# Altium schematic sheet sfpp_conn.SchDoc: SFP+ connectors
size A3; Date: DO NOT USE, RATHER USE PROJ OPTIONS; DrawnBy: DO NOT USE, RATHER USE PROJ OPTIONS; Engineer: DO NOT USE, RATHER USE PROJ OPTIONS; Organization: DO NOT USE, RATHER USE PROJ OPTIONS; DocumentNumber: DO NOT USE, RATHER USE PROJ OPTIONS; Revision: DO NOT USE, RATHER USE PROJ OPTIONS; SheetNumber: 4; SheetTotal: 4; SCH_Sheet_Filename: sfpp_conn.SchDoc; CurrentTime: DO NOT USE, RATHER USE PROJ OPTIONS; Time: DO NOT USE, RATHER USE PROJ OPTIONS; DocumentFullPathAndName: DO NOT USE, RATHER USE PROJ OPTIONS; DocumentName: DO NOT USE, RATHER USE PROJ OPTIONS; ModifiedDate: DO NOT USE, RATHER USE PROJ OPTIONS; ImagePath: DO NOT USE, RATHER USE PROJ OPTIONS
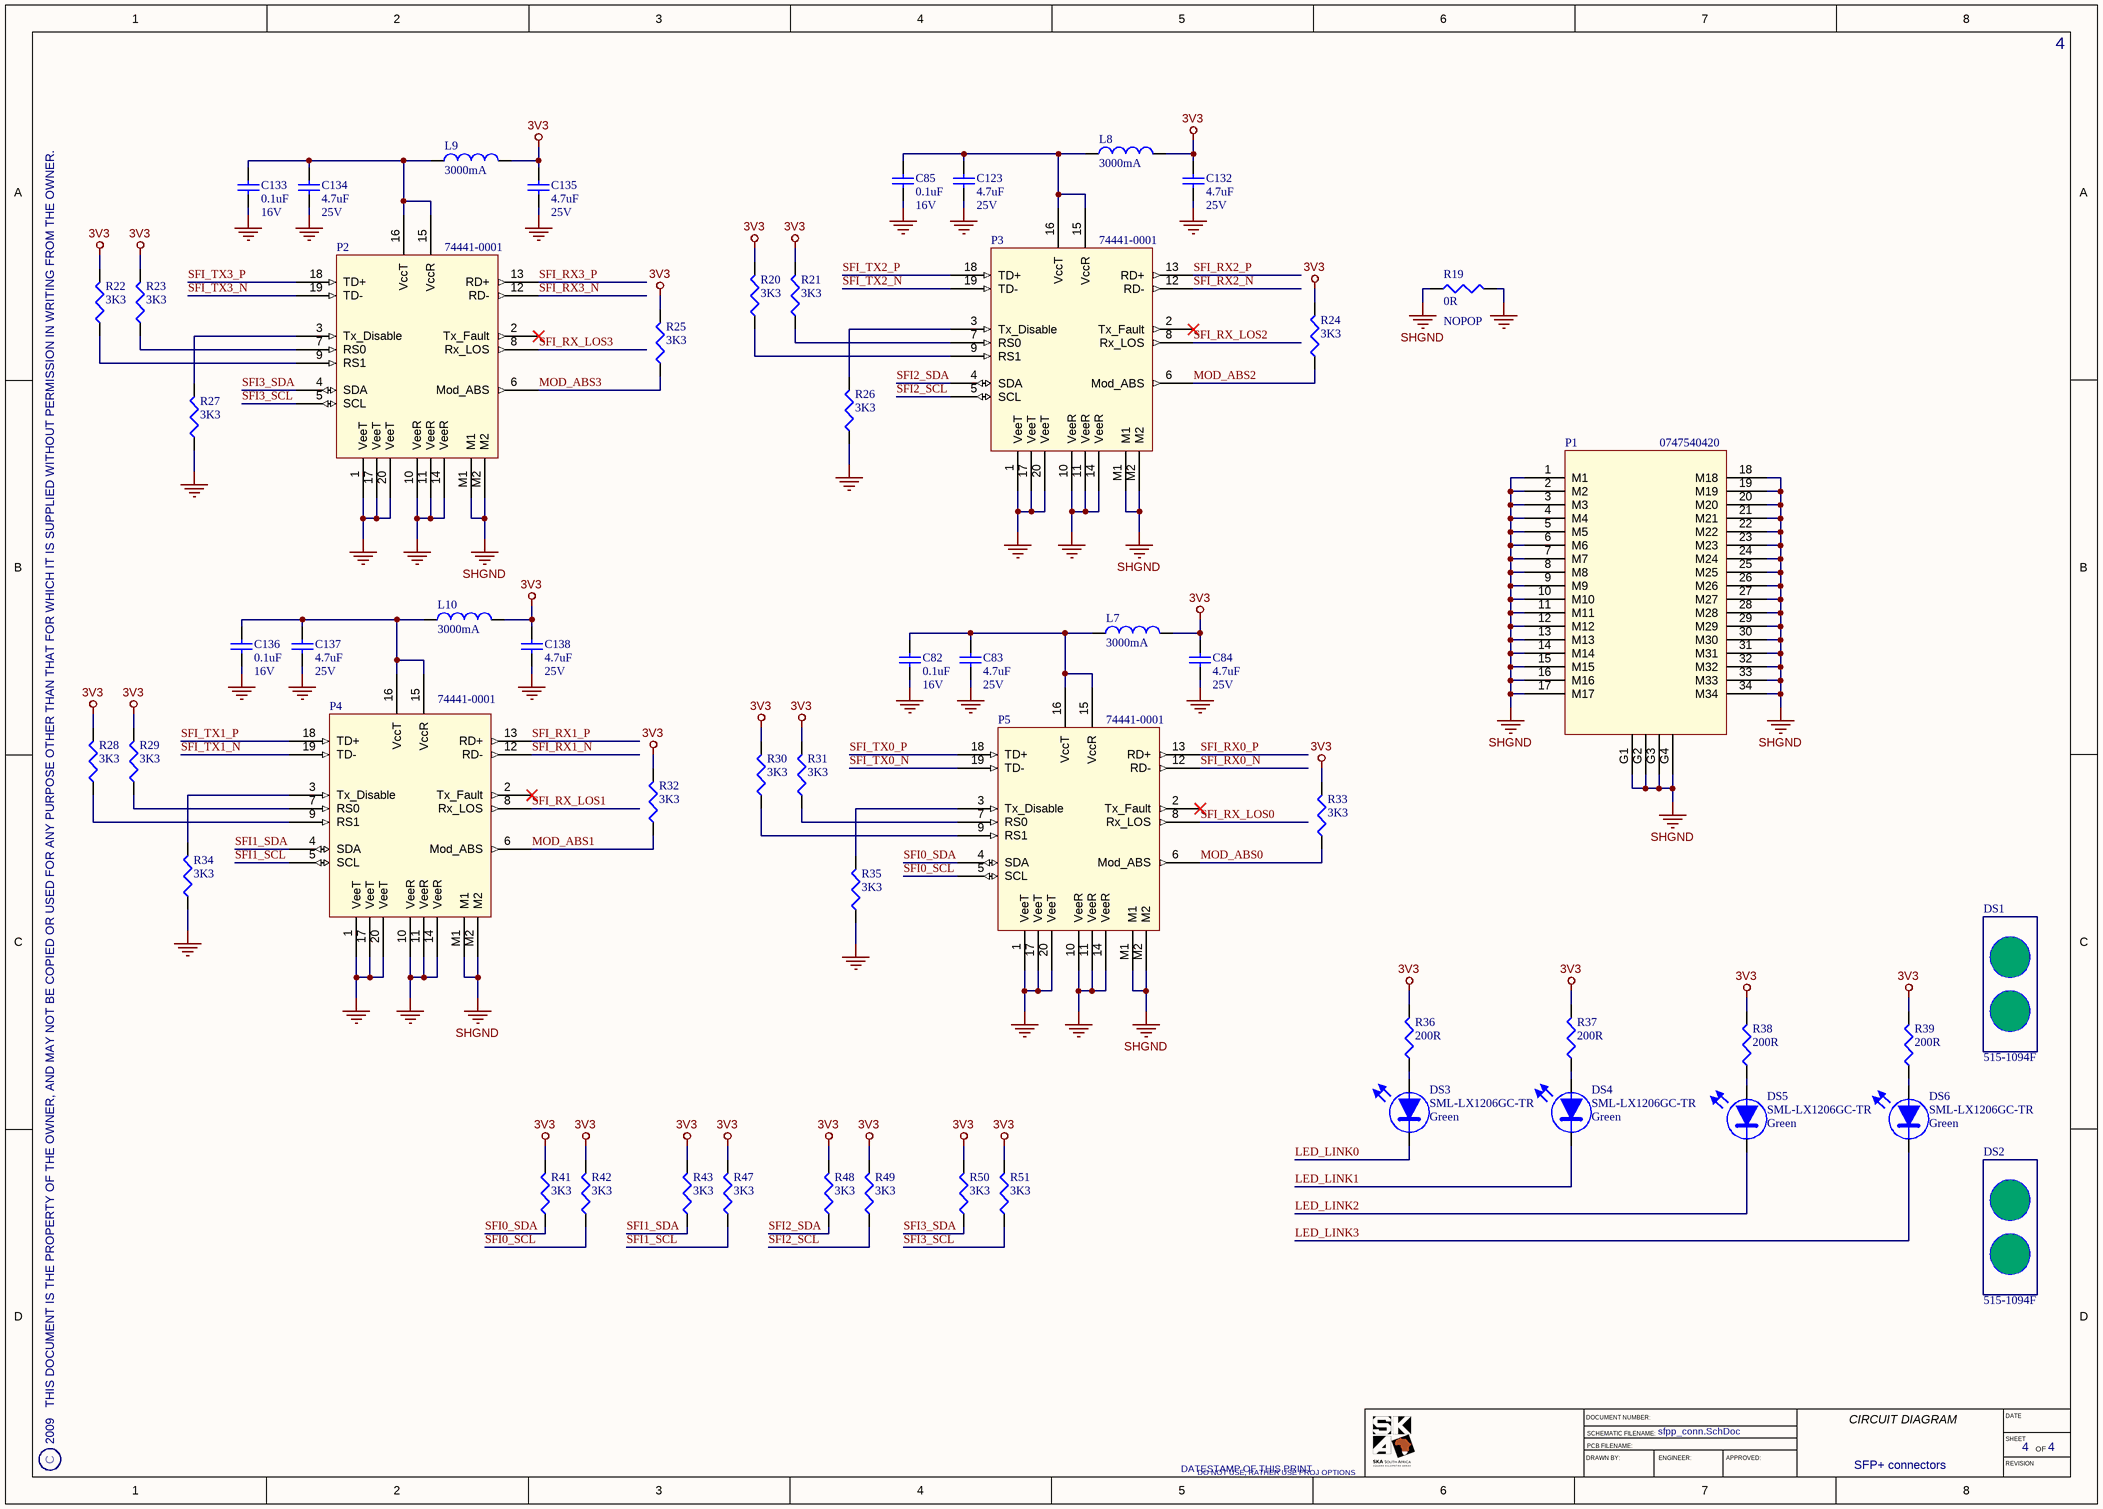
[diagram p0: sfpp_conn.SchDoc]

## Parts
C82  Rating: 16V  [CAPC1005X60L]  (hidden comment: 0.1uF)
C83  Rating: 25V  [CAPC2012X127L]  (hidden comment: 4.7uF)
C84  Rating: 25V  [CAPC2012X127L]  (hidden comment: 4.7uF)
C85  Rating: 16V  [CAPC1005X60L]  (hidden comment: 0.1uF)
C123  Rating: 25V  [CAPC2012X127L]  (hidden comment: 4.7uF)
C132  Rating: 25V  [CAPC2012X127L]  (hidden comment: 4.7uF)
C133  Rating: 16V  [CAPC1005X60L]  (hidden comment: 0.1uF)
C134  Rating: 25V  [CAPC2012X127L]  (hidden comment: 4.7uF)
C135  Rating: 25V  [CAPC2012X127L]  (hidden comment: 4.7uF)
C136  Rating: 16V  [CAPC1005X60L]  (hidden comment: 0.1uF)
C137  Rating: 25V  [CAPC2012X127L]  (hidden comment: 4.7uF)
C138  Rating: 25V  [CAPC2012X127L]  (hidden comment: 4.7uF)
DS1  515-1094F  [DIALIGHT_515-1094F]
DS2  515-1094F  [DIALIGHT_515-1094F]
DS3  SML-LX1206GC-TR  Colour: Green  [LEDC3216X120N]
DS4  SML-LX1206GC-TR  Colour: Green  [LEDC3216X120N]
DS5  SML-LX1206GC-TR  Colour: Green  [LEDC3216X120N]
DS6  SML-LX1206GC-TR  Colour: Green  [LEDC3216X120N]
L7  Rating: 3000mA  [INDC3216X130L]  (hidden comment: 120R)
L8  Rating: 3000mA  [INDC3216X130L]  (hidden comment: 120R)
L9  Rating: 3000mA  [INDC3216X130L]  (hidden comment: 120R)
L10  Rating: 3000mA  [INDC3216X130L]  (hidden comment: 120R)
P1  0747540420  [MOLEX_0747540420]
P2  74441-0001  [MOLEX_74441-0001]
P3  74441-0001  [MOLEX_74441-0001]
P4  74441-0001  [MOLEX_74441-0001]
P5  74441-0001  [MOLEX_74441-0001]
R19  0R  [RESC1005X40L]
R20  3K3  [RESC1005X40L]
R21  3K3  [RESC1005X40L]
R22  3K3  [RESC1005X40L]
R23  3K3  [RESC1005X40L]
R24  3K3  [RESC1005X40L]
R25  3K3  [RESC1005X40L]
R26  3K3  [RESC1005X40L]
R27  3K3  [RESC1005X40L]
R28  3K3  [RESC1005X40L]
R29  3K3  [RESC1005X40L]
R30  3K3  [RESC1005X40L]
R31  3K3  [RESC1005X40L]
R32  3K3  [RESC1005X40L]
R33  3K3  [RESC1005X40L]
R34  3K3  [RESC1005X40L]
R35  3K3  [RESC1005X40L]
R36  200R  [RESC1005X40L]
R37  200R  [RESC1005X40L]
R38  200R  [RESC1005X40L]
R39  200R  [RESC1005X40L]
R41  3K3  [RESC1005X40L]
R42  3K3  [RESC1005X40L]
R43  3K3  [RESC1005X40L]
R47  3K3  [RESC1005X40L]
R48  3K3  [RESC1005X40L]
R49  3K3  [RESC1005X40L]
R50  3K3  [RESC1005X40L]
R51  3K3  [RESC1005X40L]

## Nets
3V3: C84.2 C132.2 C135.2 C138.2 L7.2 L8.2 L9.2 L10.2 R20.2 R21.2 R22.2 R23.2 R24.2 R25.2 R28.2 R29.2 R30.2 R31.2 R32.2 R33.2 R36.2 R37.2 R38.2 R39.2 R41.2 R42.2 R43.2 R47.2 R48.2 R49.2 R50.2 R51.2
GND: C82.1 C83.1 C84.1 C85.1 C123.1 C132.1 C133.1 C134.1 C135.1 C136.1 C137.1 C138.1 P2.1(VeeT) P2.10(VeeR) P2.11(VeeR) P2.14(VeeR) P2.17(VeeT) P2.20(VeeT) P3.1(VeeT) P3.10(VeeR) P3.11(VeeR) P3.14(VeeR) P3.17(VeeT) P3.20(VeeT) P4.1(VeeT) P4.10(VeeR) P4.11(VeeR) P4.14(VeeR) P4.17(VeeT) P4.20(VeeT) P5.1(VeeT) P5.10(VeeR) P5.11(VeeR) P5.14(VeeR) P5.17(VeeT) P5.20(VeeT) R19.2 R26.1 R27.1 R34.1 R35.1
SHGND: P1.1(M1) P1.2(M2) P1.3(M3) P1.4(M4) P1.5(M5) P1.6(M6) P1.7(M7) P1.8(M8) P1.9(M9) P1.10(M10) P1.11(M11) P1.12(M12) P1.13(M13) P1.14(M14) P1.15(M15) P1.16(M16) P1.17(M17) P1.18(M18) P1.19(M19) P1.20(M20) P1.21(M21) P1.22(M22) P1.23(M23) P1.24(M24) P1.25(M25) P1.26(M26) P1.27(M27) P1.28(M28) P1.29(M29) P1.30(M30) P1.31(M31) P1.32(M32) P1.33(M33) P1.34(M34) P1.G1 P1.G2 P1.G3 P1.G4 P2.M1 P2.M2 P3.M1 P3.M2 P4.M1 P4.M2 P5.M1 P5.M2 R19.1
LED_LINK0: DS3.1(K)
LED_LINK1: DS4.1(K)
LED_LINK2: DS5.1(K)
LED_LINK3: DS6.1(K)
MOD_ABS0: P5.6(Mod_ABS) R33.1
MOD_ABS1: P4.6(Mod_ABS) R32.1
MOD_ABS2: P3.6(Mod_ABS) R24.1
MOD_ABS3: P2.6(Mod_ABS) R25.1
SFI0_SCL: P5.5(SCL) R42.1
SFI0_SDA: P5.4(SDA) R41.1
SFI1_SCL: P4.5(SCL) R47.1
SFI1_SDA: P4.4(SDA) R43.1
SFI2_SCL: P3.5(SCL) R49.1
SFI2_SDA: P3.4(SDA) R48.1
SFI3_SCL: P2.5(SCL) R51.1
SFI3_SDA: P2.4(SDA) R50.1
SFI_RX0_N: P5.12(RD-)
SFI_RX0_P: P5.13(RD+)
SFI_RX1_N: P4.12(RD-)
SFI_RX1_P: P4.13(RD+)
SFI_RX2_N: P3.12(RD-)
SFI_RX2_P: P3.13(RD+)
SFI_RX3_N: P2.12(RD-)
SFI_RX3_P: P2.13(RD+)
SFI_RX_LOS0: P5.8(Rx_LOS)
SFI_RX_LOS1: P4.8(Rx_LOS)
SFI_RX_LOS2: P3.8(Rx_LOS)
SFI_RX_LOS3: P2.8(Rx_LOS)
SFI_TX0_N: P5.19(TD-)
SFI_TX0_P: P5.18(TD+)
SFI_TX1_N: P4.19(TD-)
SFI_TX1_P: P4.18(TD+)
SFI_TX2_N: P3.19(TD-)
SFI_TX2_P: P3.18(TD+)
SFI_TX3_N: P2.19(TD-)
SFI_TX3_P: P2.18(TD+)
NetC82_2: C82.2 C83.2 L7.1 P5.15(VccR) P5.16(VccT)
NetC85_2: C85.2 C123.2 L8.1 P3.15(VccR) P3.16(VccT)
NetC133_2: C133.2 C134.2 L9.1 P2.15(VccR) P2.16(VccT)
NetC136_2: C136.2 C137.2 L10.1 P4.15(VccR) P4.16(VccT)
NetDS3_2: DS3.2(A) R36.1
NetDS4_2: DS4.2(A) R37.1
NetDS5_2: DS5.2(A) R38.1
NetDS6_2: DS6.2(A) R39.1
NetP2_3: P2.3(Tx_Disable) R27.2
NetP2_7: P2.7(RS0) R23.1
NetP2_9: P2.9(RS1) R22.1
NetP3_3: P3.3(Tx_Disable) R26.2
NetP3_7: P3.7(RS0) R21.1
NetP3_9: P3.9(RS1) R20.1
NetP4_3: P4.3(Tx_Disable) R34.2
NetP4_7: P4.7(RS0) R29.1
NetP4_9: P4.9(RS1) R28.1
NetP5_3: P5.3(Tx_Disable) R35.2
NetP5_7: P5.7(RS0) R31.1
NetP5_9: P5.9(RS1) R30.1

Not connected (* = marked no-connect by the designer): P2 2(Tx_Fault)*; P3 2(Tx_Fault)*; P4 2(Tx_Fault)*; P5 2(Tx_Fault)*

## Notes on the sheet
- (near R19) NOPOP
- 2009   THIS DOCUMENT IS THE PROPERTY OF THE OWNER, AND MAY NOT BE COPIED OR USED FOR ANY PURPOSE OTHER THAN THAT FOR WHICH IT IS SUPPLIED WITHOUT PERMISSION IN WRITING FROM THE OWNER.
- C
- DATESTAMP OF THIS PRINT
- DRAWN BY:
- DOCUMENT NUMBER:
- SCHEMATIC FILENAME:
- PCB FILENAME:
- ENGINEER:
- APPROVED:
- CIRCUIT DIAGRAM
- DATE
- SHEET
- REVISION
- OF

## Library data of the parts
C82 C85 C133 C136 = CAP-CER-1: 0.1uF, Ceramic Capacitor; Manufacturer: VENKEL; PartNum: C0402X7R160-104KN; Tolerance: 10%; Dielectric: X7R; POD number: CAP-CER-1; Value: 0.1uF; RoHS: Y; Sort Value: 0.1; Category: Capacitors; Subcategory: Ceramic
C83 C84 C123 C132 C134 C135 C137 C138 = CAP-CER-3: 4.7uF, Ceramic Capacitor; Manufacturer: MURATA; PartNum: GRM21BR61E475KA12K; Tolerance: 10%; Dielectric: X5R; POD number: CAP-CER-3; Value: 4.7uF; RoHS: Y; Sort Value: 4.7; Category: Capacitors; Subcategory: Ceramic
DS1 DS2 = OPTO-LPIPE-1: 2-High, press-fit, 3mm round, light-pipe; Manufacturer: Dialight; Colour: NA; POD number: OPTO-LPIPE-1; PartNum: 515-1094F; RoHS: Y; Vdrop: NA; Rating: NA; Category: OPTO; Subcategory: LPIPE
DS3-DS6 = OPTO-LED-0: Green, Surface mount, LED, 1206; Manufacturer: LUMEX; Vdrop: 2.2V; Rating: 20mA; POD number: OPTO-LED-0; PartNum: SML-LX1206GC-TR; RoHS: Y; Category: OPTO; Subcategory: LED
L7-L10 = IND-FB-1: 120 Ohm, Chip Ferrite Brad; Manufacturer: Murata; PartNum: BLM31PG121SN1; DC Res: 0.025R; Tolerance: 25%; POD number: IND-FB-1; RoHS: Y; Value: 120R; Sort Value: 120; Category: Inductors; Subcategory: FerriteBead
P1 = CONN-PCB-26: SFP+ 1X4 Cage Assembly; Manufacturer: Molex; POD number: CONN-PCB-26; PartNum: 0747540420; RoHS: Y; Category: CONN; Subcategory: PCB
P2-P5 = CONN-PCB-27: 20 Circuit, 0.8mm pitch SFP+ host connector; Manufacturer: Molex; POD number: CONN-PCB-27; PartNum: 74441-0001; RoHS: Y; Category: CONN; Subcategory: PCB
R19 = RES-TF-0: 0R, 1.1mm x 0.5mm, Thick Film Resistor; Manufacturer: ROYALOHM; PartNum: 0402WG00000T1E; Tolerance: 0%; Rating: 0.0625W; POD number: RES-TF-0; Value: 0R; Sort Value: 0; Category: Resistors; Subcategory: ThickFilm; HelpURL: http://www.royalohm.com/pdf/general.pdf
R20-R35 R41-R43 R47-R51 = RES-TF-7: 3K3, 1.1mm x 0.5mm, Thick Film Resistor; Manufacturer: ROYALOHM; PartNum: 0402WGJ0332T1E; Tolerance: 5%; Rating: 0.0625W; POD number: RES-TF-7; Value: 3K3; Sort Value: 3300; Category: Resistors; Subcategory: ThickFilm; HelpURL: http://www.royalohm.com/pdf/general.pdf
R36-R39 = RES-TF-19: 200R, 1.1mm x 0.5mm, Thick Film Resistor; Manufacturer: ROYALOHM; PartNum: 0402WGF0201T1E; Tolerance: 1%; Rating: 0.0625W; POD number: RES-TF-19; Value: 200R; Sort Value: 200; Category: Resistors; Subcategory: ThickFilm; HelpURL: http://www.royalohm.com/pdf/general.pdf